# EAGLE schematic Joystick (EAGLE 6.3)
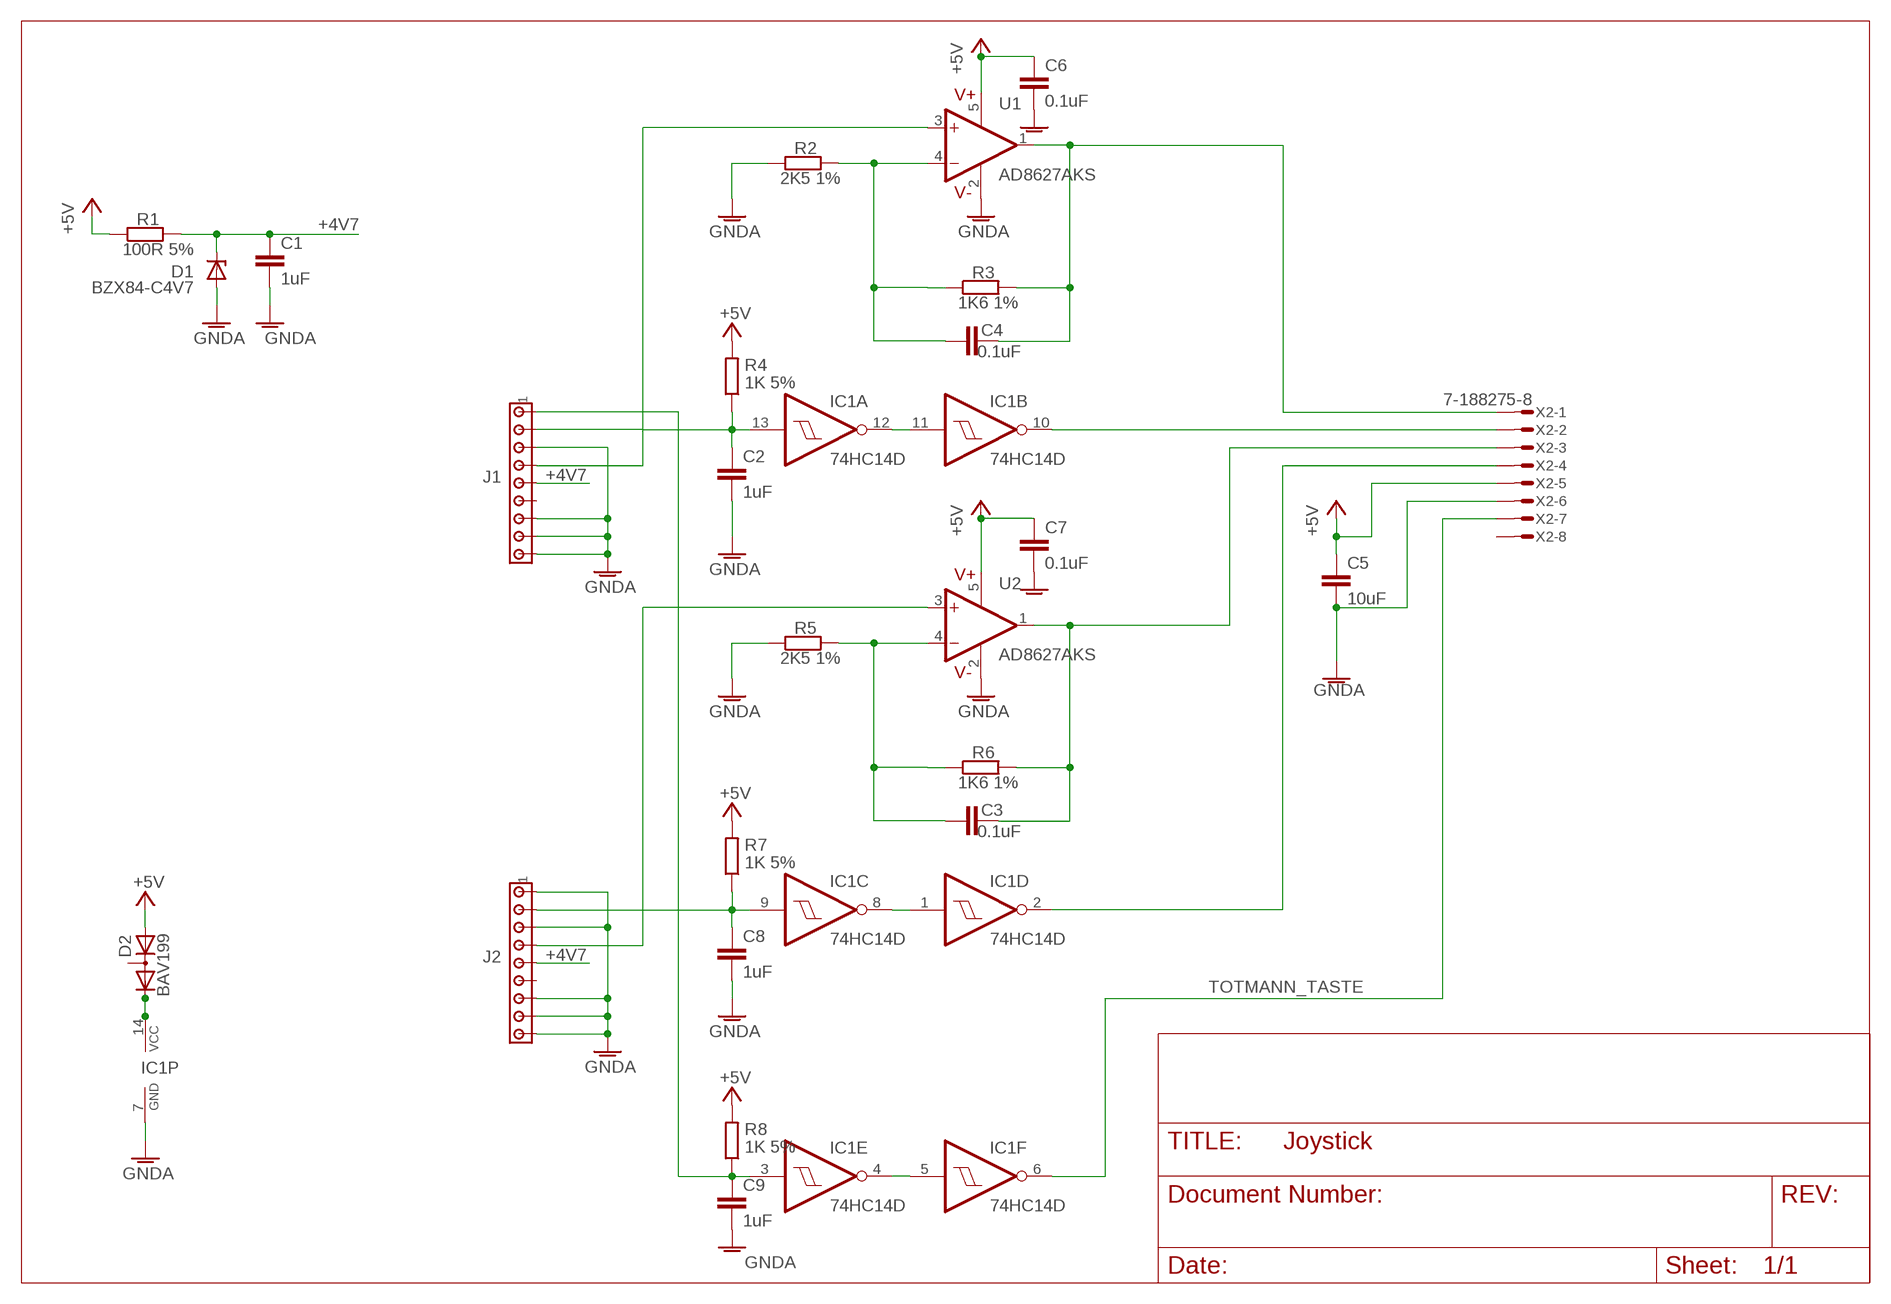
[diagram p0: schematic, sheet 1]

## Parts
C1  1uF  C-EUC0805  [C0805]
C2  1uF  C-EUC0805  [C0805]
C3  0.1uF  C-EUC0805  [C0805]
C4  0.1uF  C-EUC0805  [C0805]
C5  10uF  C-EUC0805  [C0805]
C6  0.1uF  C-EUC0805  [C0805]
C7  0.1uF  C-EUC0805  [C0805]
C8  1uF  C-EUC0805  [C0805]
C9  1uF  C-EUC0805  [C0805]
D1  BZX84-C4V7  ZENER-DIODESOT23  [SOT23]
D2  BAV199  [SOT23]
IC1  74HC14D  [SO14]
J1  MTA09-100  [10X09MTA]
J2  MTA09-100  [10X09MTA]
R1  100R 5%  R-EU_R0805  [R0805]
R2  2K5 1%  R-EU_R0805  [R0805]
R3  1K6 1%  R-EU_R0805  [R0805]
R4  1K 5%  R-EU_R0805  [R0805]
R5  2K5 1%  R-EU_R0805  [R0805]
R6  1K6 1%  R-EU_R0805  [R0805]
R7  1K 5%  R-EU_R0805  [R0805]
R8  1K 5%  R-EU_R0805  [R0805]
U1  AD8627AKS  [SC70(KS-5)]
U2  AD8627AKS  [SC70(KS-5)]
X2  7-188275-8  MICROMATCH-8SMF  [MMT-F-SMD-8]

## Nets
+4V7: C1.1 D1.3(C) J1.5 J2.5 R1.2
+5V: C5.1 C6.1 C7.1 D2.1(A) R1.1 R4.2 R7.2 R8.2 U1.5(V+) U2.5(V+) X2.5
GNDA: C1.2 C2.2 C5.2 C6.2 C7.2 C8.2 C9.2 D1.1(A) IC1.7(P:GND) J1.3 J1.7 J1.8 J1.9 J2.1 J2.3 J2.7 J2.8 J2.9 R2.1 R5.1 U1.2(V-) U2.2(V-) X2.6
N$1: J2.4 U2.3(+IN)
N$2: C3.1 R5.2 R6.1 U2.4(-IN)
N$3: C3.2 R6.2 U2.1(OUT) X2.3
N$4: IC1.4(E:O) IC1.5(F:I)
N$5: IC1.10(B:O) X2.2
N$6: D2.2(C) IC1.14(P:VCC)
N$7: IC1.11(B:I) IC1.12(A:O)
N$8: IC1.1(D:I) IC1.8(C:O)
N$9: C2.1 IC1.13(A:I) J1.2 R4.1
N$10: IC1.2(D:O) X2.4
N$11: C8.1 IC1.9(C:I) J2.2 R7.1
N$12: C9.1 IC1.3(E:I) J1.1 R8.1
N$19: J1.4 U1.3(+IN)
N$27: C4.1 R2.2 R3.1 U1.4(-IN)
N$37: C4.2 R3.2 U1.1(OUT) X2.1
TOTMANN_TASTE: IC1.6(F:O) X2.7
Unconnected: D2.3(AC) J1.6 J2.6 X2.8

## Library data of the parts
C1-C9 = rcl:C-EU: CAPACITOR, European symbol
D1 = diode:ZENER-DIODE: Z-Diode
D2 = diode:BAV199: DIODE low-leakage double diode
IC1 = 74xx-eu:74*14: Hex schmitt trigger INVERTER
J1 J2 = con-amp:MTA09-100: AMP connector
R1-R8 = rcl:R-EU_: RESISTOR, European symbol
U1 U2 = my_components:AD8627
X2 = con-amp-micromatch:MICROMATCH-8: MicroMaTch 8 7-215464-8 / 0-215464-8 Drawing Number C-215464 DDEController.pdf